# Altium schematic sheet Led-7Segment-Switch.SchDoc
size 254 x 241 mm; SheetNumber: 3; SheetTotal: 8
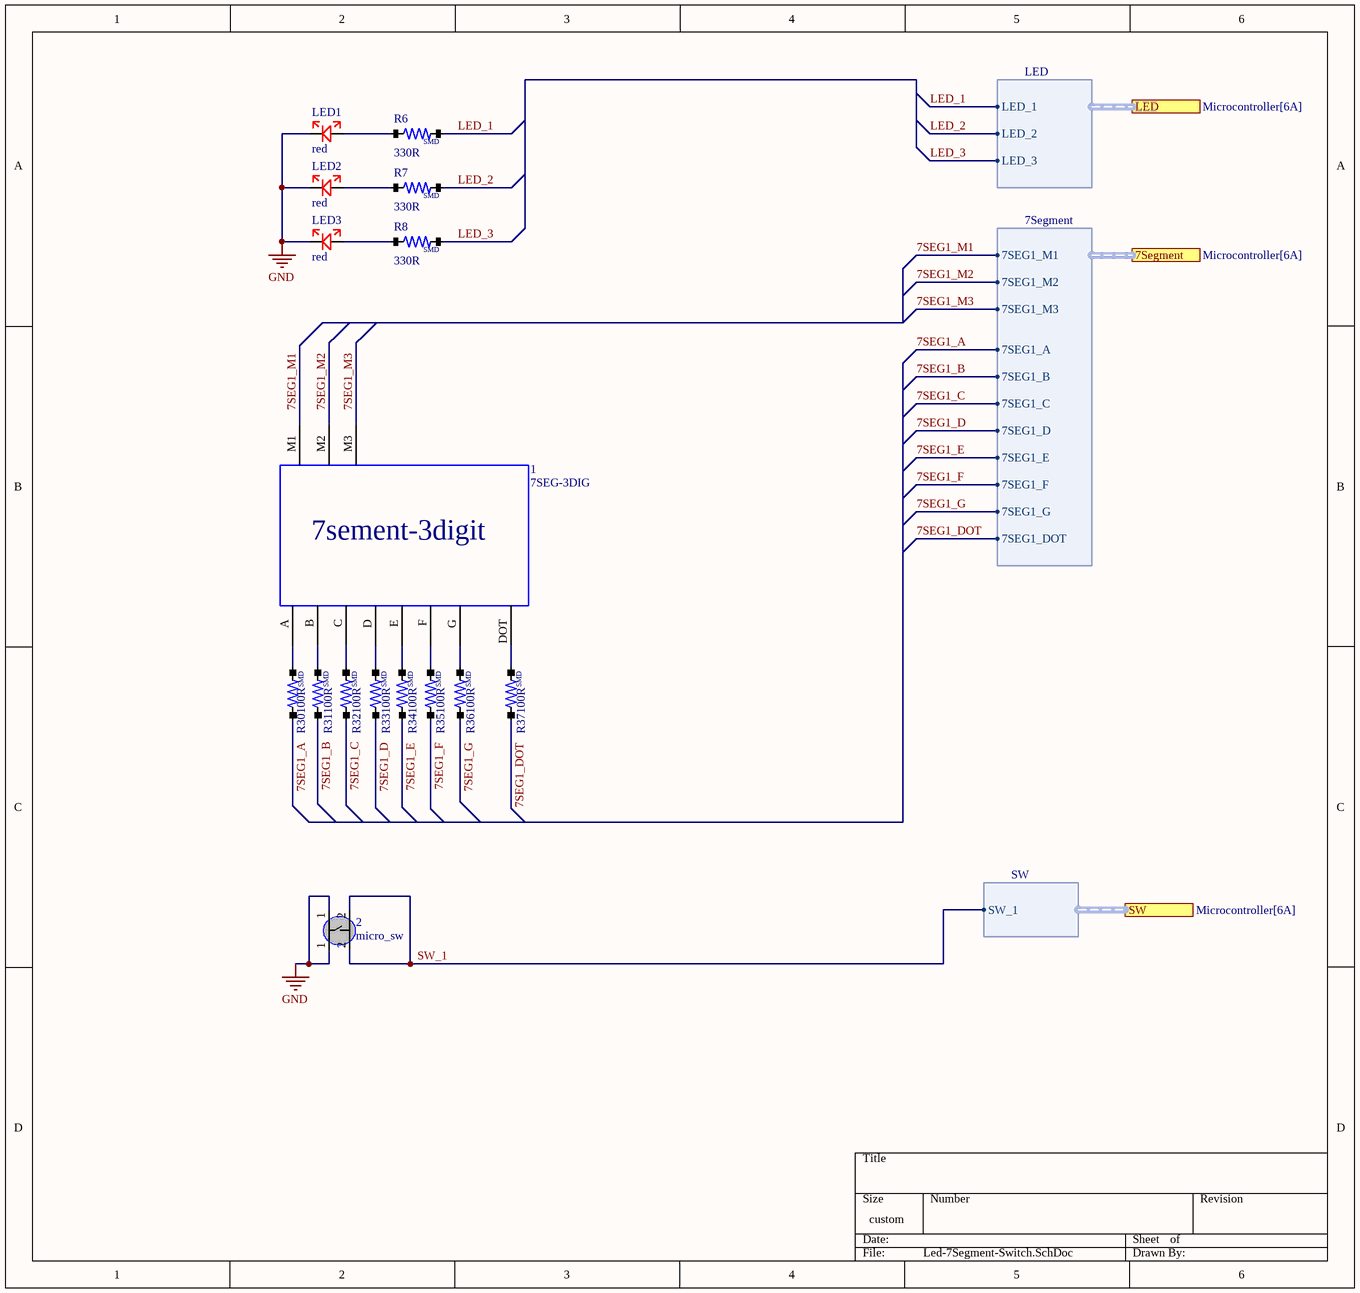
[diagram p0: Led-7Segment-Switch.SchDoc]

## Parts
1  7SEG-3DIG  [7seg-3d]
2  micro_sw  [micro_switch_smd]
LED1  red  [LED/0805]
LED2  red  [LED/0805]
LED3  red  [LED/0805]
R6  330R  [RES/0603]
R7  330R  [RES/0603]
R8  330R  [RES/0603]
R30  100R  [RES/0603]
R31  100R  [RES/0603]
R32  100R  [RES/0603]
R33  100R  [RES/0603]
R34  100R  [RES/0603]
R35  100R  [RES/0603]
R36  100R  [RES/0603]
R37  100R  [RES/0603]

## Ports
7Segment (harness 7Segment, see Microcontroller[6A]), LED (harness LED, see Microcontroller[6A]), SW (harness SW, see Microcontroller[6A])

## Harnesses
LED: LED_1, LED_2, LED_3
7Segment: 7SEG1_M1, 7SEG1_M2, 7SEG1_M3, 7SEG1_A, 7SEG1_B, 7SEG1_C, 7SEG1_D, 7SEG1_E, 7SEG1_F, 7SEG1_G, 7SEG1_DOT
SW: SW_1

## Nets
GND: 2.1 LED1.A LED2.A LED3.A
7SEG1_A: R30.1 ; port 7Segment.7SEG1_A
7SEG1_B: R31.1 ; port 7Segment.7SEG1_B
7SEG1_C: R32.1 ; port 7Segment.7SEG1_C
7SEG1_D: R33.1 ; port 7Segment.7SEG1_D
7SEG1_DOT: R37.1 ; port 7Segment.7SEG1_DOT
7SEG1_E: R34.1 ; port 7Segment.7SEG1_E
7SEG1_F: R35.1 ; port 7Segment.7SEG1_F
7SEG1_G: R36.1 ; port 7Segment.7SEG1_G
7SEG1_M1: 1.M1 ; port 7Segment.7SEG1_M1
7SEG1_M2: 1.M2 ; port 7Segment.7SEG1_M2
7SEG1_M3: 1.M3 ; port 7Segment.7SEG1_M3
LED_1: R6.2 ; port LED.LED_1
LED_2: R7.2 ; port LED.LED_2
LED_3: R8.2 ; port LED.LED_3
SW_1: 2.2 ; port SW.SW_1
Net1_A: 1.A R30.2
Net1_B: 1.B R31.2
Net1_C: 1.C R32.2
Net1_D: 1.D R33.2
Net1_DOT: 1.DOT R37.2
Net1_E: 1.E R34.2
Net1_F: 1.F R35.2
Net1_G: 1.G R36.2
NetLED1_K: LED1.K R6.1
NetLED2_K: LED2.K R7.1
NetLED3_K: LED3.K R8.1

## Notes on the sheet
- (in symbol 7SEG-3DIG) 7sement-3digit
- (in symbol RES/SMD) SMD

## Library data of the parts
LED1-LED3 = LED-1COLER
R6-R8 R30-R37 = RES/SMD